# EAGLE schematic breakout (EAGLE 6.5.0)

## Sheet 1 of 2
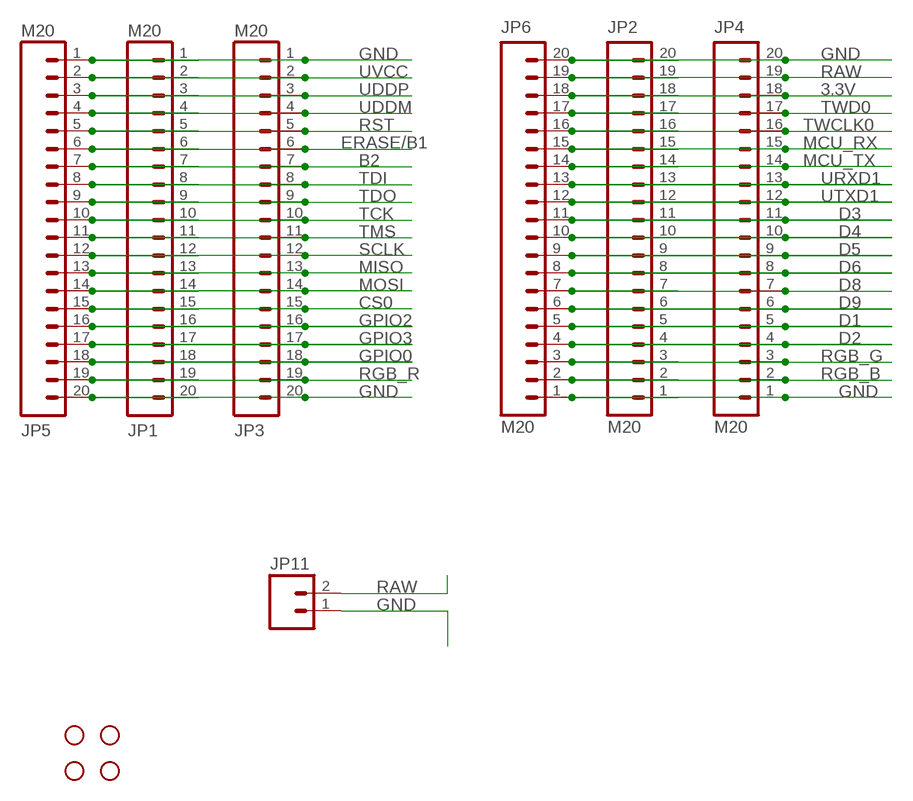
[diagram p0: schematic, sheet 1]

### Parts
JP1  M20  [1X20]
JP2  M20  [1X20]
JP3  M20  [1X20]
JP4  M20  [1X20]
JP5  M20  [1X20]
JP6  M20  [1X20]
JP7  STAND-OFF  [STAND-OFF]
JP8  STAND-OFF  [STAND-OFF]
JP9  STAND-OFF  [STAND-OFF]
JP10  STAND-OFF  [STAND-OFF]
JP11  M02JST-PTH-2  [JST-2-PTH]

### Nets
3.3V: JP2.18 JP4.18 JP6.18
B2: JP1.7 JP3.7 JP5.7
CS0: JP1.15 JP3.15 JP5.15
D1: JP2.5 JP4.5 JP6.5
D2: JP2.4 JP4.4 JP6.4
D3: JP2.11 JP4.11 JP6.11
D4: JP2.10 JP4.10 JP6.10
D5: JP2.9 JP4.9 JP6.9
D6: JP2.8 JP4.8 JP6.8
D8: JP2.7 JP4.7 JP6.7
D9: JP2.6 JP4.6 JP6.6
ERASE/B1: JP1.6 JP3.6 JP5.6
GND [Power]: JP1.1 JP1.20 JP2.1 JP2.20 JP3.1 JP3.20 JP4.1 JP4.20 JP5.1 JP5.20 JP6.1 JP6.20 JP11.1
GPIO0: JP1.18 JP3.18 JP5.18
GPIO2: JP1.16 JP3.16 JP5.16
GPIO3: JP1.17 JP3.17 JP5.17
MCU_RX: JP2.15 JP4.15 JP6.15
MCU_TX: JP2.14 JP4.14 JP6.14
MISO: JP1.13 JP3.13 JP5.13
MOSI: JP1.14 JP3.14 JP5.14
RAW [Power]: JP2.19 JP4.19 JP6.19 JP11.2
RGB_B: JP2.2 JP4.2 JP6.2
RGB_G: JP2.3 JP4.3 JP6.3
RGB_R: JP1.19 JP3.19 JP5.19
RST: JP1.5 JP3.5 JP5.5
SCLK: JP1.12 JP3.12 JP5.12
TCK: JP1.10 JP3.10 JP5.10
TDI: JP1.8 JP3.8 JP5.8
TDO: JP1.9 JP3.9 JP5.9
TMS: JP1.11 JP3.11 JP5.11
TWCLK0: JP2.16 JP4.16 JP6.16
TWD0: JP2.17 JP4.17 JP6.17
UDDM: JP1.4 JP3.4 JP5.4
UDDP: JP1.3 JP3.3 JP5.3
URXD1: JP2.13 JP4.13 JP6.13
UTXD1: JP2.12 JP4.12 JP6.12
UVCC: JP1.2 JP3.2 JP5.2

## Sheet 2 of 2

## Library data of the parts
JP1-JP6 = SparkFun:M20: This is just like the LOCK variant in that the holes are staggared by 5 mil, but except for the last two holes. They are not altered from the "standard" footprint layout. This is used for a special purpose on the layout of our Graphic LCD Backpack. Make sure you want to use this device before selecting it for you project!
JP7-JP10 = SparkFun:STAND-OFF: Stand Off This is the mechanical footprint for a #4 phillips button head screw. Use the keepout ring to avoid running the screw head into surrounding components. SKU : PRT-00447
JP11 = SparkFun:M02: Header 2 Standard 2-pin 0.1" header. Use with straight break away headers (SKU : PRT-00116), right angle break away headers (PRT-00553), swiss pins (PRT-00743), machine pins (PRT-00117), and female headers (PRT-00115). Molex polarized connector foot print use with SKU : PRT-08233 with associated crimp pins and housings.

## Net classes
0 default: width 0.152 mm, drill 0.152 mm, clearance 0.102 mm
1 Power: width 0.152 mm, drill 0.152 mm, clearance 0.102 mm